# Altium schematic sheet Communications.SchDoc
size A4
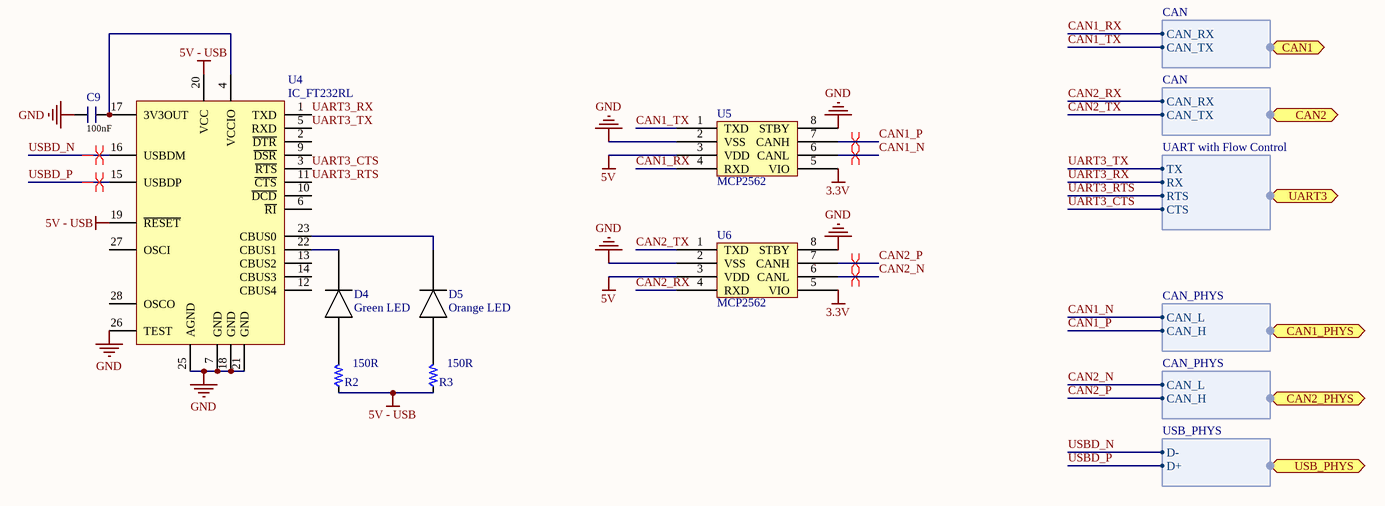
[diagram p0: Communications.SchDoc]

## Parts
C9  Capacitance: 100nF  [PCB_GENERIC_SMD_0603]  (hidden comment: SCH_GENERIC_CAPACITOR_0603)
D4  Green LED  [SMD_0603_LED]
D5  Orange LED  [SMD_0603_LED]
R2  Resistance: 150R  [PCB_GENERIC_SMD_0603]  (hidden comment: SCH_GENERIC_RESISTOR_0603)
R3  Resistance: 150R  [PCB_GENERIC_SMD_0603]  (hidden comment: SCH_GENERIC_RESISTOR_0603)
U4  IC_FT232RL  [SSOP-28]
U5  MCP2562  [MCP2562]
U6  MCP2562  [MCP2562]

## Ports
CAN1 (harness CAN), CAN1_PHYS (harness CAN_PHYS), CAN2 (harness CAN), CAN2_PHYS (harness CAN_PHYS), UART3 (harness UART with Flow Control), USB_PHYS (harness USB_PHYS)

## Harnesses
CAN_PHYS: CAN_L, CAN_H
CAN: CAN_RX, CAN_TX
UART with Flow Control: TX, RX, RTS, CTS
USB_PHYS: D-, D+

## Nets
3.3V: U5.5(VIO) U6.5(VIO)
5V: U5.3(VDD) U6.3(VDD)
5V - USB: R2.1 R3.1 U4.19(~{RESET}) U4.20(VCC)
GND: C9.2 U4.7(GND) U4.18(GND) U4.21(GND) U4.25(AGND) U4.26(TEST) U5.2(VSS) U5.8(STBY) U6.2(VSS) U6.8(STBY)
NC: U4.8(NC) U4.24(NC)
CAN1_N: U5.6(CANL) ; port CAN1_PHYS.CAN_L
CAN1_P: U5.7(CANH) ; port CAN1_PHYS.CAN_H
CAN1_RX: U5.4(RXD) ; port CAN1.CAN_RX
CAN1_TX: U5.1(TXD) ; port CAN1.CAN_TX
CAN2_N: U6.6(CANL) ; port CAN2_PHYS.CAN_L
CAN2_P: U6.7(CANH) ; port CAN2_PHYS.CAN_H
CAN2_RX: U6.4(RXD) ; port CAN2.CAN_RX
CAN2_TX: U6.1(TXD) ; port CAN2.CAN_TX
UART3_CTS: U4.3(~{RTS}) ; port UART3.CTS
UART3_RTS: U4.11(~{CTS}) ; port UART3.RTS
UART3_RX: U4.1(TXD) ; port UART3.RX
UART3_TX: U4.5(RXD) ; port UART3.TX
USBD_N: U4.16(USBDM) ; port USB_PHYS.D-
USBD_P: U4.15(USBDP) ; port USB_PHYS.D+
NetC9_1: C9.1 U4.4(VCCIO) U4.17(3V3OUT)
NetD4_1: D4.1 R2.2
NetD4_2: D4.2 U4.22(CBUS1)
NetD5_1: D5.1 R3.2
NetD5_2: D5.2 U4.23(CBUS0)

Not connected (* = marked no-connect by the designer): U4 2(~{DTR}) 6(~{RI}) 9(~{DSR}) 10(~{DCD}) 12(CBUS4) 13(CBUS2) 14(CBUS3) 27(OSCI) 28(OSCO)

## Layout directives
differential pair: CAN1_N, CAN1_P, CAN2_N, CAN2_P, USBD_N, USBD_P

## Library data of the parts
C9 = SCH_GENERIC_CAPACITOR_0603: Generic SMD capacitor 0603; Tolerance: *%
D4 D5 = SMD_0603_LED
R2 R3 = SCH_GENERIC_RESISTOR_0603: Generic SMD resistor 0603
U4 = IC_FT232RL: FT232R USB UART; Manufacturer: *; Note: *; ManufacturerPartNo: *